# EAGLE design final version (EAGLE 8.7.0)
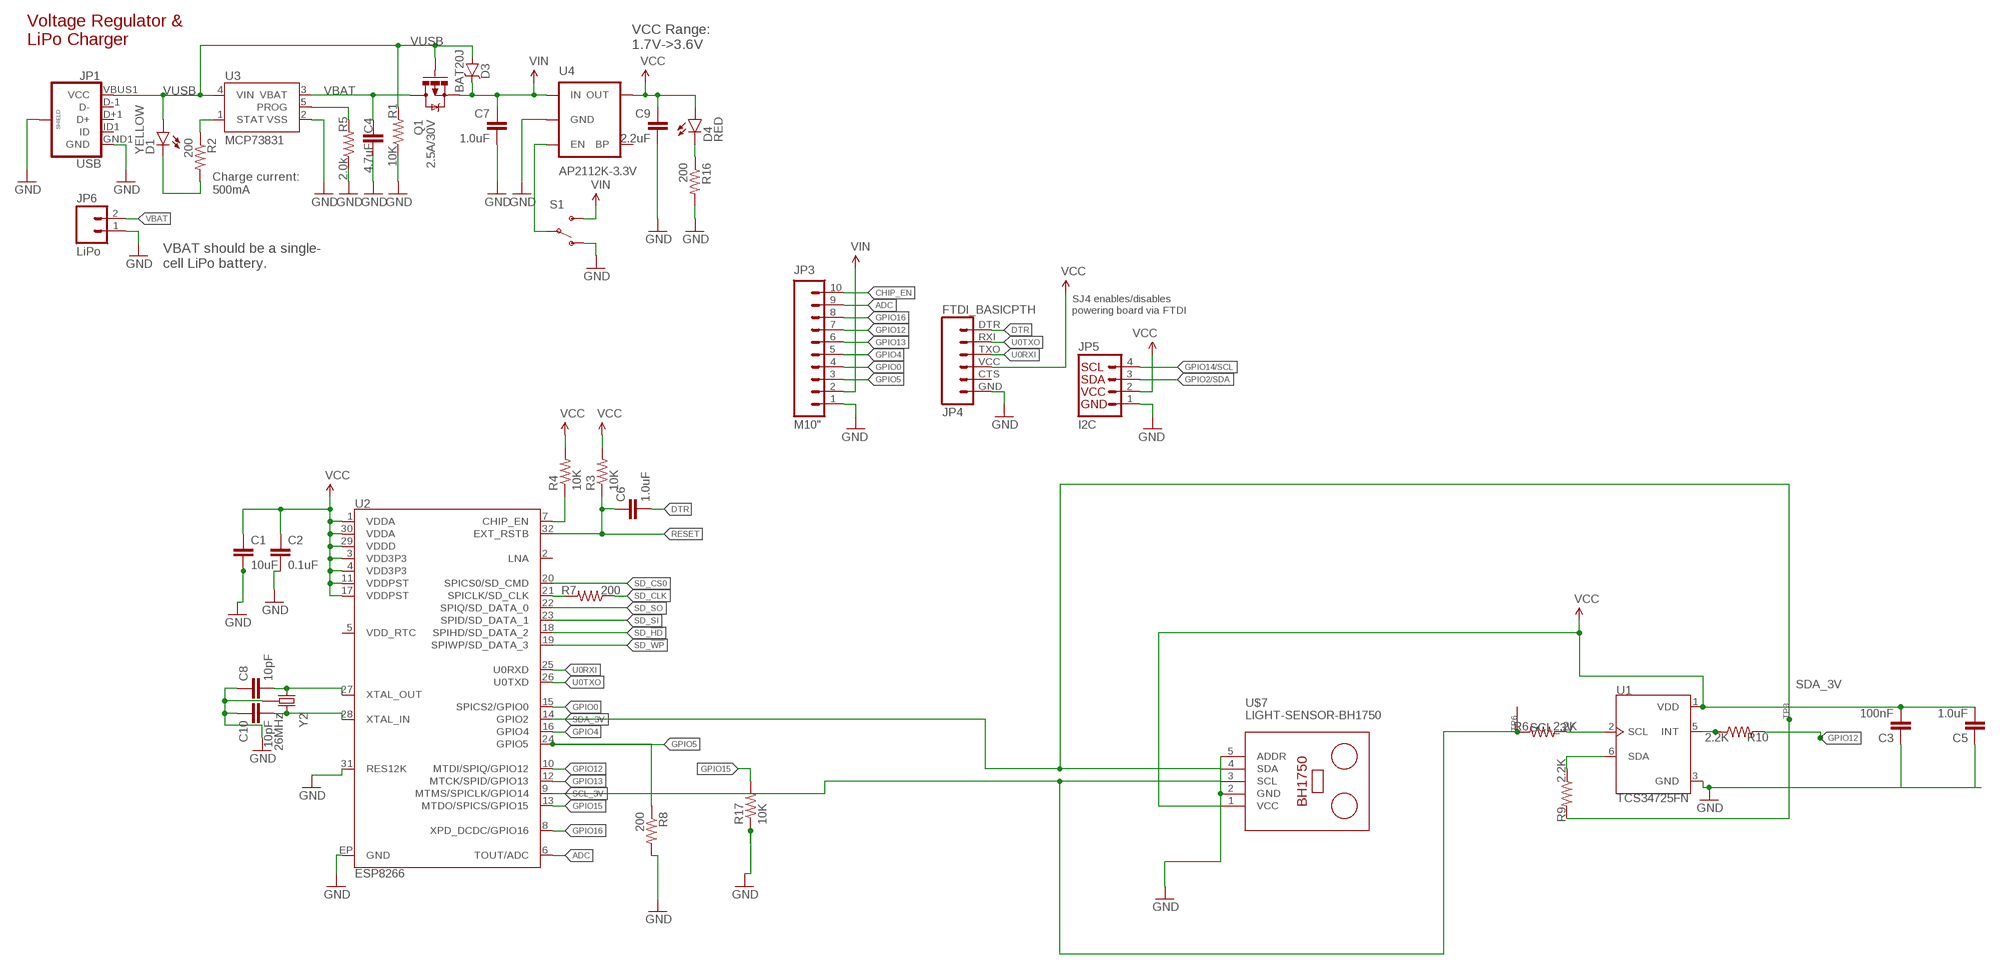
[diagram p0: schematic, sheet 1]

## Parts
C1  10uF  10UF-6.3V-20%(0603)  [0603-CAP]
C2  0.1uF  0.1UF-25V(+80/-20%)(0603)  [0603-CAP]
C3  100nF  1.0UF-16V-10%(0603)  [0603-CAP]
C4  4.7uF  4.7UF-6.3V-10%(0603)0603  [0603-CAP]
C5  1.0uF  1.0UF-16V-10%(0603)  [0603-CAP]
C6  1.0uF  1.0UF-16V-10%(0603)  [0603-CAP]
C7  1.0uF  1.0UF-25V-+80/-20(0805)  [0805]
C8  10pF  10PF-50V-5%(0603)  [0603-CAP]
C9  2.2uF  2.2UF-10V-20%(0603)  [0603-CAP]
C10  10pF  10PF-50V-5%(0603)  [0603-CAP]
D1  YELLOW  LED-YELLOW0603  [LED-0603]
D3  BAT20J  DIODE-SCHOTTKY-BAT20J  [SOD-323]
D4  RED  LED-RED0603  [LED-0603]
JP1  USB  USB_MICROB_PLUGCONN-11752  [USB-B-MICRO-SMD_V03]
JP3  M10"  [1X10]
JP4  FTDI_BASICPTH  [FTDI_BASIC]
JP5  I2C  I2C_STANDARD  [1X04]
JP6  LiPo  M02JST-PTH-2  [JST-2-PTH]
Q1  2.5A/30V  MOSFET-PCHANNELDMG2307L  [SOT23-3]
R1  10K  10KOHM1/10W1%(0603)0603  [0603-RES]
R2  200  200OHM1/10W1%(0603)  [0603-RES]
R3  10K  10KOHM1/10W1%(0603)0603  [0603-RES]
R4  10K  10KOHM1/10W1%(0603)0603  [0603-RES]
R5  2.0k  2.0KOHM1/10W5%(0603)  [0603-RES]
R6  2.2K  200OHM1/10W1%(0603)  [0603-RES]
R7  200  200OHM1/10W1%(0603)  [0603-RES]
R8  200  200OHM1/10W1%(0603)  [0603-RES]
R9  2.2K  200OHM1/10W1%(0603)  [0603-RES]
R10  2.2K  200OHM1/10W1%(0603)  [0603-RES]
R16  200  200OHM1/10W1%(0603)  [0603-RES]
R17  10K  10KOHM1/10W1%(0603)0603  [0603-RES]
S1  SWITCH-SPDT-SMD-A  [SWITCH-SPST-SMD-A]
TP3  SEWTAP0.5IN  [SEWINGTAP_0.5]
TP6  SEWTAP0.5IN  [SEWINGTAP_0.5]
U1  TCS34725FN  [SON65P200X240X70-6N]
U2  ESP8266  [QFN32]
U3  MCP73831  [SOT23-5]
U4  AP2112K-3.3V  V_REG_LDOSMD  [SOT23-5]
U$7  LIGHT-SENSOR-BH1750  [LIGHT-SENSOR-BH1750]
Y2  26MHz  CRYSTAL-GROUNDED3.2X2.5  [CRYSTAL-SMD-3.2X2.5]

## Nets
ADC: JP3.9 U2.6(TOUT/ADC)
CHIP_EN: JP3.10 R4.1 U2.7(CHIP_EN)
DTR: C6.2 JP4.DTR
GND: C1.2 C2.2 C3.1 C4.2 C5.1 C7.2 C8.1 C9.2 C10.1 JP1.GND1(GND) JP1.SHIELD1(SHIELD) JP1.SHIELD2(SHIELD) JP1.SHIELD3(SHIELD) JP3.1 JP4.GND JP5.1 JP6.1 R1.1 R5.1 R8.2 R16.2 R17.1 S1.1(O) U1.3(GND) U2.31(RES12K) U2.EP(GND) U3.2(VSS) U4.2(GND) U$7.2(GND) U$7.5(ADDR) Y2.2(GND) Y2.4(GND)
GPIO0: JP3.4 U2.15(SPICS2/GPIO0)
GPIO2/SDA: JP5.3
GPIO4: JP3.5 U2.16(GPIO4)
GPIO5: JP3.3 R8.1 U2.24(GPIO5)
GPIO12: JP3.7 U2.10(MTDI/SPIQ/GPIO12)
GPIO13: JP3.6 U2.12(MTCK/SPID/GPIO13)
GPIO14/SCL: JP5.4
GPIO15: R17.2 U2.13(MTDO/SPICS/GPIO15)
GPIO16: JP3.8 U2.8(XPD_DCDC/GPIO16)
N$1: R10.1 U1.5(INT)
N$2: R9.1 U1.6(SDA)
N$3: R6.1 U1.2(SCL)
N$4: C10.2 U2.28(XTAL_IN) Y2.3
N$5: D4.C R16.1
N$6: C8.2 U2.27(XTAL_OUT) Y2.1
N$7: R10.2
N$8: S1.2(P) U4.3(EN)
N$9: R7.2 U2.21(SPICLK/SD_CLK)
N$14: R5.2 U3.5(PROG)
N$17: D1.C R2.2
N$18: R2.1 U3.1(STAT)
RESET: C6.1 R3.1 U2.32(EXT_RSTB)
SCL_3V: R6.2 TP6.TAP(SEW) U2.9(MTMS/SPICLK/GPIO14) U$7.3(SCL)
SD_!HD!: U2.18(SPIHD/SD_DATA_2)
SD_!WP!: U2.19(SPIWP/SD_DATA_3)
SD_CLK: R7.1
SD_CS0: U2.20(SPICS0/SD_CMD)
SD_SI: U2.23(SPID/SD_DATA_1)
SD_SO: U2.22(SPIQ/SD_DATA_0)
SDA_3V: R9.2 TP3.TAP(SEW) U2.14(GPIO2) U$7.4(SDA)
U0RXI: JP4.TXO U2.25(U0RXD)
U0TXO: JP4.RXI U2.26(U0TXD)
VBAT: C4.1 JP6.2 Q1.3(D) U3.3(VBAT)
VCC: C1.1 C2.1 C3.2 C5.2 C9.1 D4.A JP4.VCC JP5.2 R3.2 R4.2 U1.1(VDD) U2.1(VDDA) U2.3(VDD3P3) U2.4(VDD3P3) U2.11(VDDPST) U2.17(VDDPST) U2.29(VDDD) U2.30(VDDA) U4.5(OUT) U$7.1(VCC)
VIN: C7.1 D3.C JP3.2 Q1.2(S) S1.3(S) U4.1(IN)
VUSB: D1.A D3.A JP1.VBUS1(VCC) Q1.1(G) R1.2 U3.4(VIN)
Unconnected: JP1.D+1(D+) JP1.D-1(D-) JP1.ID1(ID) JP4.CTS U2.2(LNA) U2.5(VDD_RTC) U4.4(BP)

## Notes on the sheet
- Voltage Regulator &
  LiPo Charger
- VCC Range:
  1.7V->3.6V
- Charge current:
  500mA
- VBAT should be a single-
  cell LiPo battery.
- SJ4 enables/disables
  powering board via FTDI

## Library data of the parts
C1 = SparkFun-Capacitors:10UF-6.3V-20%(0603): CAP-11015; PROD_ID: CAP-11015
C2 = SparkFun-Capacitors:0.1UF-25V(+80/-20%)(0603): CAP-00810 Ceramic Standard decoupling cap; PROD_ID: CAP-00810
C3 = SparkFun-Capacitors:1.0UF-16V-10%(0603): CAP-00868; PROD_ID: CAP-00868; VALUE: 1.0uF
C4 = SparkFun-Capacitors:4.7UF-6.3V-10%(0603): CAP-08280; PROD_ID: CAP-08280
C5 C6 = SparkFun-Capacitors:1.0UF-16V-10%(0603): CAP-00868; PROD_ID: CAP-00868
C7 = SparkFun-Capacitors:1.0UF-25V-+80/-20(0805): CAP-11625; PROD_ID: CAP-11625
C8 C10 = SparkFun-Capacitors:10PF-50V-5%(0603): CAP-11812; PROD_ID: CAP-11812
C9 = SparkFun-Capacitors:2.2UF-10V-20%(0603): CAP-07888; PROD_ID: CAP-07888
D1 = SparkFun-LED:LED-YELLOW: Yellow SMD LEDs LilyPad 1206- DIO-09909 0603- DIO-09003; PROD_ID: DIO-09003
D3 = SparkFun-DiscreteSemi:DIODE-SCHOTTKY: Schottky diodes in SFE's production catalog BAT20J 1A 23V 0.62Vf RB751 120mA 40V 0.37Vf PMEG4005EJ 0.5A 40V 0.42Vf MBRA140 1A 40V 0.5Vf B340A 3A 40V SMA; PROD_ID: DIO-11623
D4 = SparkFun-LED:LED-RED: Assorted Red LEDs LilyPad 1206- DIO-09912 1206- DIO-00809 0603- DIO-00819; PROD_ID: DIO-00819
JP1 = SparkFun-Connectors:USB_MICROB_PLUG: USB Micro-B connectors Some male, some female. Watch your step!; PROD_ID: CONN-11752
JP3 = SparkFun-Connectors:M10: Header 10 Standard 10-pin 0.1" header. Use with straight break away headers (SKU : PRT-00116), right angle break away headers (PRT-00553), swiss pins (PRT-00743), machine pins (PRT-00117), and female headers (PRT-00115).
JP4 = SparkFun-Connectors:FTDI_BASIC: FTDI Basic header with labels
JP5 = SparkFun-Connectors:I2C_STANDARD: SparkFun has standardized on a pinout for all I2C based sensor breakouts. This pinout allows I2C boards to be plugged directly into the headers on Arduino Uno compatible boards, and to be daisy chained easily.
JP6 = SparkFun-Connectors:M02: Standard 2-pin 0.1" header. Use with - straight break away headers ( PRT-00116) - right angle break away headers (PRT-00553) - swiss pins (PRT-00743) - machine pins (PRT-00117) - female headers (PRT-00115) Molex polarized connector foot print use with: PRT-08233 with associated crimp pins and housings. 2.54_SCREWTERM for use with PRT-10571. 3.5mm Screw Terminal footprints for PRT-08084 5mm Screw Terminal footprints for use with PRT-08432; SKU: PRT-09914
Q1 = SparkFun-DiscreteSemi:MOSFET-PCHANNEL: Generic PMOSFET IRLML2244 - TRANS-11153 (SOT-23 -20V -4.3A) (1.Gate 2.Source 3.Drain) FQP27P06 - COM-10349 <http://www.sparkfun.com/products/10349> (TO-220 -60V -27A) (1.Gate 2.Source 3.Drain); PROD_ID: TRANS-11308
R1 R3 R4 R17 = SparkFun-Resistors:10KOHM1/10W1%(0603): RES-00824; PROD_ID: RES-00824
R2 R7 R8 R16 = SparkFun-Resistors:200OHM1/10W1%(0603): RES-08220; PROD_ID: RES-08220
R5 = SparkFun-Resistors:2.0KOHM1/10W5%(0603): RES-08296; PROD_ID: RES-08296
R6 R9 R10 = SparkFun-Resistors:200OHM1/10W1%(0603): RES-08220; PROD_ID: RES-08220; VALUE: 200
S1 = SparkFun-Electromechanical:SWITCH-SPDT: SPDT Switch Simple slide switch, Spark Fun Electronics SKU : COM-00102 DPDT SMT slide switch, AYZ0202, SWCH-08179; PROD_ID: SWCH-10651
TP3 TP6 = adafruit:SEWTAP
U1 = TCS34725FN:TCS34725FN: Color Light To Digital with IR Filter; DESCRIPTION: Color Light To Digital with IR Filter; DIGI-KEY_PART_NUMBER: TCS34725FNCT-ND; DIGI-KEY_PURCHASE_URL: https://www.digikey.com/product-detail/en/ams/TCS34725FN/TCS34725FNCT-ND/3737688?utm_source=snapeda&utm_medium=aggregator&utm_campaign=symbol; MF: ams; MP: TCS34725FN; PACKAGE: SMD-6 ams
U2 = SparkFun-RF:ESP8266: Espressif ESP8266 WiFi Smart Connectivity Platform.; PROD_ID: IC-12452
U3 = SparkFun-PowerIC:MCP73831: Miniature single cell, fully integrated Li-Ion, Li-polymer charge management controller http://ww1.microchip.com/downloads/en/DeviceDoc/21984a.pdf IC-09995; PROD_ID: IC-09995
U4 = SparkFun-PowerIC:V_REG_LDO: Voltage Regulator LDO Standard 150mA LDO voltage regulator in SOT-23 layout. Micrel part MIC5205. BP (by-pass) pin is used to lower output noise with 470pF cap.; PROD_ID: VREG-12457
U$7 = diy-modules:LIGHT-SENSOR-BH1750: Digital Light Sensor based on BH1750 BH1750 datasheet is available here: http://www.mouser.com/ds/2/348/bh1750fvi-e-186247.pdf Arduino Library for BH1750 is available here: https://github.com/claws/BH1750 Video Tutorial is available here: https://www.youtube.com/watch?v=UsLcHSbxf_8 Click here to find device on ebay.com <http://www.ebay.com/sch/bh1750fvi+module> Note: There are many variants. Search for the proper version.
Y2 = things:CRYSTAL-GROUNDED; PROD_ID: XTAL-12454

## Board
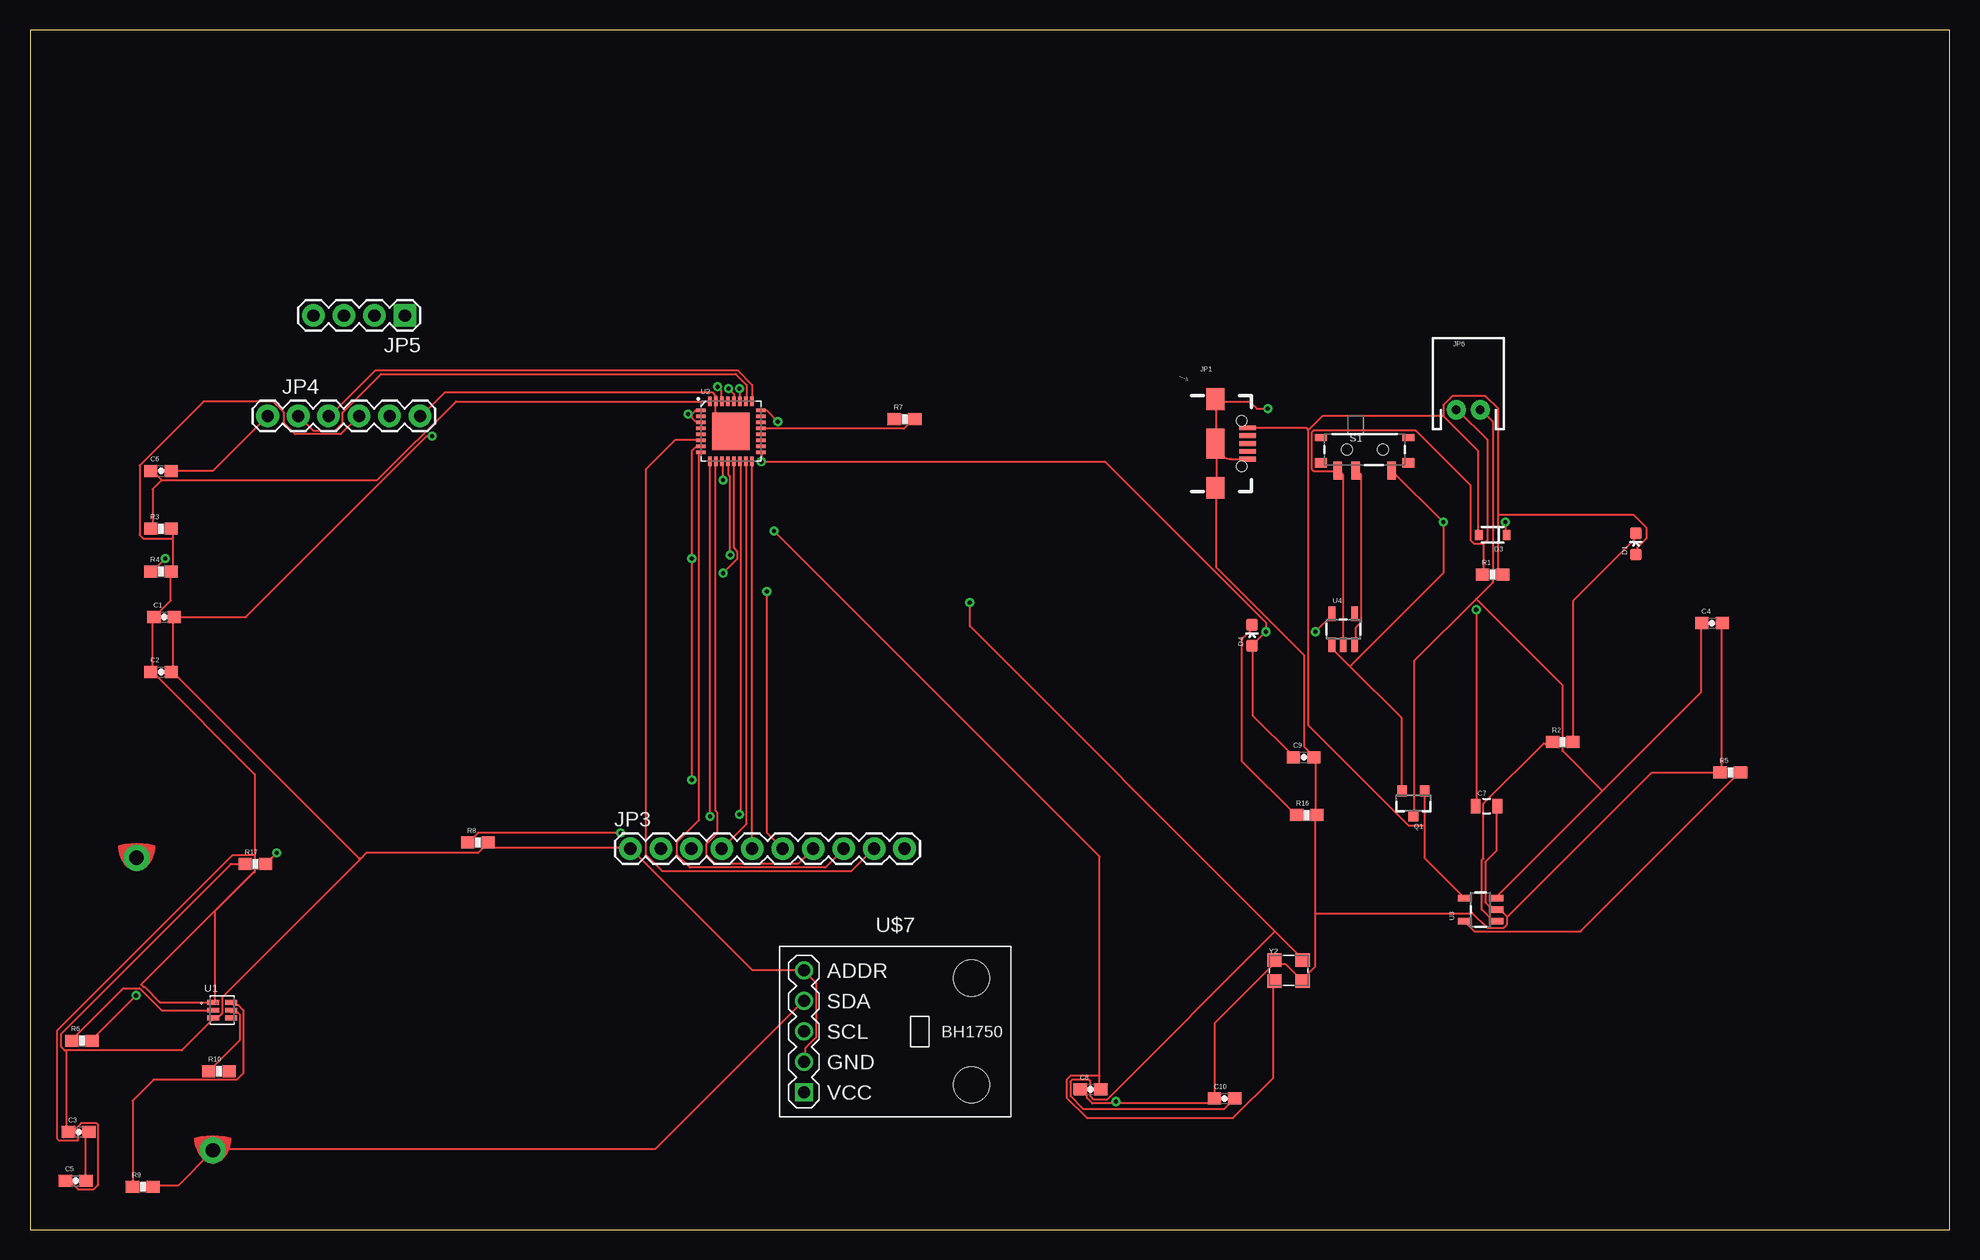
[diagram p1: board, top side]
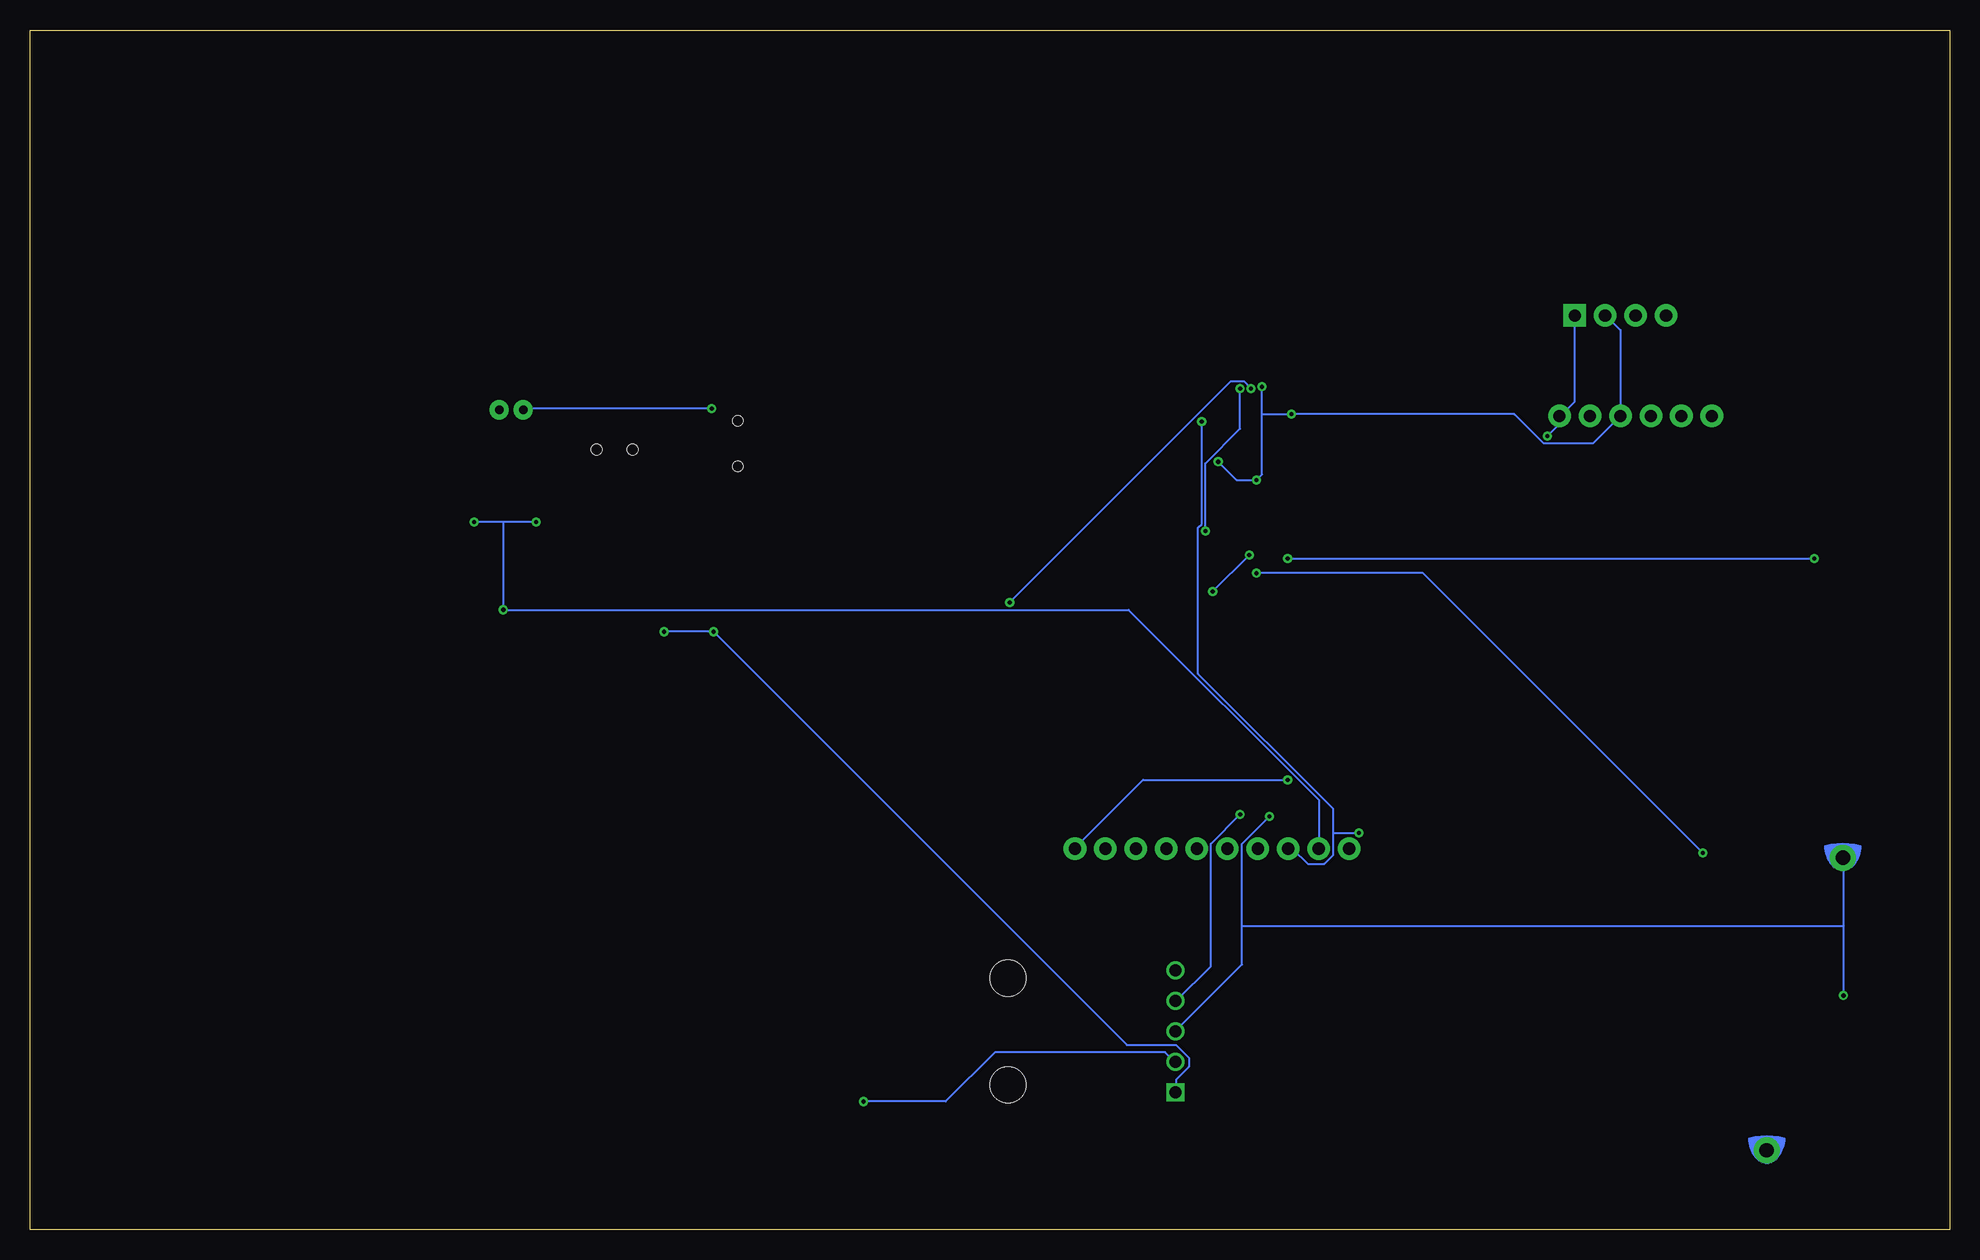
[diagram p2: board, bottom side, seen from below]

Size 160 x 100 mm. Coordinates in mm from the lower left corner, seen from the top.
Outline: 0,0 160,0 160,100 0,100 0,0
Copper layers (1*16): Top 0.035mm / dielectric 1.5mm / Bottom 0.035mm
Design rules "default": minimum track width 6mil, minimum drill 0.35mm, track to track 6mil, track to pad 6mil, pad to pad 6mil, via to via 6mil, smd to smd 6mil, copper to edge 40mil, drill to drill 6mil, minimum pad ring 10mil, minimum via ring 8mil, stop-mask expansion 4mil, vias tented up to drill 0mil, thermal gap 10mil

### Footprints (pad centres in the part's own frame; a part is rotated, then mirrored left to right if it is on the bottom)
0603-CAP = smd 1.1 x 1: 1 -0.85,0; 2 0.85,0
0805 = smd 0.8 x 1.2: 1 -0.9,0; 2 0.9,0
LED-0603 = smd 1 x 1: A 0,-0.877; C 0,0.877
SOD-323 = smd 0.63 x 0.83: A 1.15,0; C -1.15,0
USB-B-MICRO-SMD_V03 = smd 1.4 x 0.4: D+1 2.7,0; D-1 2.7,0.65; GND1 2.7,-1.3; ID1 2.7,-0.65; VBUS1 2.7,1.3 | smd 1.5 x 1.8: SHIELD1 0,3.7; SHIELD2 0,-3.7 | smd 1.5 x 2.5: SHIELD3 0,0 | hole 0.85: 2.2,1.9; 2.2,-1.9
1X10 = drill 1.016 pad 1.88: 1 0,0; 2 2.54,0; 3 5.08,0; 4 7.62,0; 5 10.16,0; 6 12.7,0; 7 15.24,0; 8 17.78,0; 9 20.32,0; 10 22.86,0
FTDI_BASIC = drill 1.016 pad 1.88: CTS 10.16,0; DTR 0,0; GND 12.7,0; RXI 2.54,0; TXO 5.08,0; VCC 7.62,0
1X04 = drill 1.016 pad 1.88 square: 1 0,0 | drill 1.016 pad 1.88: 2 2.54,0; 3 5.08,0; 4 7.62,0
JST-2-PTH = drill 0.7 pad 1.6: 1 -1,0; 2 1,0
SOT23-3 = smd 0.8 x 0.9: 1 -0.95,-1; 2 0.95,-1; 3 0,1.1
0603-RES = smd 1.1 x 1: 1 -0.85,0; 2 0.85,0
SWITCH-SPST-SMD-A = smd 0.7 x 1.5: 1 -2.25,-1.75; 2 -0.75,-1.75; 3 2.25,-1.75 | smd 1 x 0.6: GND1 -3.65,1; GND3 3.65,1 | smd 1 x 0.8: GND2 -3.65,-1.1; GND4 3.65,-1.1 | hole 0.9: -1.5,0; 1.5,0
SEWINGTAP_0.5 = drill 1.2 pad 2.184: TAP 0,0
SON65P200X240X70-6N = smd 1 x 0.4: 1 -0.75,0.65; 2 -0.75,0; 3 -0.75,-0.65; 4 0.75,-0.65; 5 0.75,0; 6 0.75,0.65
QFN32 = smd 0.8 x 0.285: 1 -2.5,1.75; 2 -2.5,1.25; 3 -2.5,0.75; 4 -2.5,0.25; 5 -2.5,-0.25; 6 -2.5,-0.75; 7 -2.5,-1.25; 8 -2.5,-1.75; 17 2.5,-1.75; 18 2.5,-1.25; 19 2.5,-0.75; 20 2.5,-0.25; 21 2.5,0.25; 22 2.5,0.75; 23 2.5,1.25; 24 2.5,1.75 | smd 0.285 x 0.8: 9 -1.75,-2.5; 10 -1.25,-2.5; 11 -0.75,-2.5; 12 -0.25,-2.5; 13 0.25,-2.5; 14 0.75,-2.5; 15 1.25,-2.5; 16 1.75,-2.5; 25 1.75,2.5; 26 1.25,2.5; 27 0.75,2.5; 28 0.25,2.5; 29 -0.25,2.5; 30 -0.75,2.5; 31 -1.25,2.5; 32 -1.75,2.5 | smd 3.15 x 3.15: EP 0,0
SOT23-5 = smd 0.55 x 1.2: 1 -0.95,-1.3; 2 0,-1.3; 3 0.95,-1.3; 4 0.95,1.3; 5 -0.95,1.3
LIGHT-SENSOR-BH1750 = drill 1 square: 1 -7.62,-5.08 | drill 1: 2 -7.62,-2.54; 3 -7.62,0; 4 -7.62,2.54; 5 -7.62,5.08 | hole 3: 6.35,4.445; 6.35,-4.445
CRYSTAL-SMD-3.2X2.5 = smd 1.2 x 1.1: 1 -1.175,-0.875; 2 1.175,-0.875; 3 1.175,0.875; 4 -1.175,0.875

### Placement (x,y rotation side)
C1  11.18,51.05 0 top
C2  10.92,46.48 0 top
C3  4.06,8.13 0 top
C4  140.21,50.55 0 top
C5  3.81,4.06 0 top
C6  10.92,63.25 0 top
C7  121.41,35.31 0 top
C8  88.39,11.68 0 top
C9  106.17,39.37 0 top
C10  99.57,10.92 0 top
D1  133.86,57.15 0 top
D3  121.92,57.91 180 top
D4  101.85,49.53 0 top
JP1  98.81,65.53 0 top
JP3  50.04,31.75 0 top
JP4  19.81,67.82 0 top
JP5  31.24,76.2 180 top
JP6  119.89,68.33 0 top
Q1  115.32,35.56 180 top
R1  121.92,54.61 0 top
R2  127.76,40.64 0 top
R3  10.92,58.42 0 top
R4  10.92,54.86 0 top
R5  141.73,38.1 0 top
R6  4.32,15.75 0 top
R7  72.9,67.56 0 top
R8  37.34,32.26 0 top
R9  9.4,3.56 0 top
R10  15.75,13.21 0 top
R16  106.43,34.54 0 top
R17  18.8,30.48 0 top
S1  111.25,65.02 0 top
TP3  15.24,6.6 0 top
TP6  8.89,30.99 0 top
U1  16,18.29 0 top
U2  58.42,66.55 0 top
U3  120.9,26.67 90 top
U4  109.47,50.04 0 top
U$7  72.14,16.51 0 top
Y2  104.9,21.59 0 top

### Tracks (layer width: path | path; a pad name or v marks a point on that pad's centre or on a via)
ADC
  Top 0.152: U2.6 55.78,65.84 53.8,65.84 51.36,63.4 51.36,31.24 52.73,29.87 68.43,29.87 70.26,31.7 JP3.9
CHIP_EN  (via drill 0.35)
  Top 0.152: v55.17,37.49 v55.17,55.93 55.17,64.92 55.47,65.23 55.78,65.23 U2.7 | v11.28,55.93 10.21,54.86 R4.1
  Bottom 0.152: v55.17,37.49 67.21,37.49 72.85,31.85 JP3.10 | v55.17,55.93 v11.28,55.93
DTR
  Top 0.152: C6.2 15.24,63.25 JP4.DTR
GND  (via drill 0.35)
  Top 0.152: U4.2 109.42,48.77 109.42,62.94 109.12,63.25 S1.1 108.97,63.25 106.98,63.25 106.83,63.4 106.83,66.45 106.98,66.6 115.52,66.6 120.09,62.03 120.09,57.45 120.4,57.15 121.16,57.15 | 121.16,57.15 121.16,54.71 R1.1 | 121.16,57.15 121.46,57.45 121.46,65.84 119.02,68.28 JP6.1 | C4.2 140.97,50.44 140.97,38.1 R5.1 135.18,38.1 123.14,26.06 | 98.91,65.53 98.91,61.87 JP1.SHIELD2 98.91,61.72 98.91,55.17 106.22,47.85 106.22,40.23 106.98,39.47 C9.2 107.14,39.32 107.14,34.59 R16.2 107.14,34.44 107.14,26.36 | 98.91,65.53 98.91,69.04 | 98.91,69.04 98.91,69.19 JP1.SHIELD1 98.91,69.04 | 98.91,65.53 JP1.SHIELD3 arc90 100.11,64.23 JP1.GND1 | C7.2 122.22,35.2 122.22,31.55 121.31,30.63 121.31,27.28 121.61,26.98 121.77,26.98 122.07,26.67 U3.2 122.53,26.67 123.14,26.06 | 90.53,10.52 98.3,10.52 98.6,10.82 C10.1 98.75,10.97 98.75,17.22 103.63,22.1 | 90.53,10.52 88.54,10.52 88.09,10.97 88.09,11.12 87.63,11.58 C8.1 | 103.63,22.1 Y2.4 | 107.14,26.36 107.14,21.95 106.22,21.03 Y2.2 104.69,22.1 103.63,22.1 | 123.14,26.06 123.14,25.45 122.83,25.15 121.46,25.15 120.24,26.36 107.14,26.36 | v103.17,68.43 102.26,68.43 101.65,69.04 98.91,69.04 | U2.EP 57.15,67.82 57.15,69.04 U2.31 57.15,69.19 57.15,69.49 56.84,69.8 34.59,69.8 32.61,67.82 JP4.GND | U$7.2 64.62,14.02 64.62,15.09 65.53,16 65.53,20.57 U$7.5 64.47,21.64 60.2,21.64 50.14,31.7 JP3.1 49.99,31.85 38.56,31.85 38.25,32.16 R8.2 38.1,32.16 37.34,31.39 28.04,31.39 27.58,30.94 | 11.89,46.48 11.89,51.05 C1.2 17.98,51.05 33.07,66.14 v33.53,66.14 | 27.58,30.94 16,19.36 16,17.98 15.7,17.68 15.39,17.68 U1.3 15.24,17.53 12.65,14.94 3.05,14.94
  Top 0.152: R17.1 16.76,30.48 2.59,16.31 2.59,15.24 2.9,14.94 3.05,14.94 | 11.89,46.48 27.43,30.94 27.58,30.94 | 11.89,46.48 C2.2 | v90.53,10.67 90.53,10.52 | 3.05,14.94 3.05,8.29 arc90 C3.1 2.96,7.87 3.29,7.87 4.27,8.86 5.56,8.86 5.69,8.72 5.69,3.72 5.3,3.33 4.01,3.33 3.29,4.06 C5.1
  Bottom 0.152: v103.17,68.43 118.87,68.43 JP6.1 | JP5.1 31.24,69.04 32.46,67.82 JP4.GND 32.61,67.82 32.61,67.06 v33.53,66.14 | v90.53,10.67 83.67,10.67 79.55,14.78 65.38,14.78 64.62,14.02 U$7.2
GPIO0
  Top 0.152: JP3.4 59.74,33.83 59.74,64.01 U2.15
GPIO4
  Top 0.152: JP3.5 60.2,64.01 U2.16
GPIO5  (via drill 0.35)
  Top 0.152: v62.33,67.36 61.42,68.28 60.96,68.28 U2.24 | v49.23,33.07 37.34,33.07 36.58,32.31 R8.1
  Bottom 0.152: v62.33,67.36 62.33,58.83 62.64,58.52 62.64,46.33 51.36,35.05 51.36,33.07 | 51.36,33.07 51.36,31.24 52.12,30.48 53.49,30.48 54.71,31.7 JP3.3 | 51.36,33.07 v49.23,33.07
  Bottom 0.813: 55.17,31.85 JP3.3
GPIO12
  Top 0.152: JP3.7 64.01,30.48 57.15,30.48 56.39,31.24 56.39,32.16 57.3,33.07 57.3,34.75 57.15,34.9 57.15,64.01 U2.10
GPIO13  (via drill 0.35)
  Top 0.152: v58.37,56.24 58.37,62.79 58.22,62.94 58.22,64.01 U2.12 | v61.42,53.19 61.42,33.07 JP3.6
  Bottom 0.152: v61.42,53.19 v58.37,56.24
GPIO15  (via drill 0.35)
  Top 0.152: v57.76,54.71 58.98,55.93 58.98,56.54 58.67,56.84 58.67,64.01 U2.13 | v20.57,31.39 R17.2
  Bottom 0.152: v57.76,54.71 43.89,54.71 v20.57,31.39
GPIO16
  Top 0.152: U2.8 55.78,64.77 55.78,34.14 53.95,32.31 53.95,31.24 55.02,30.18 66.29,30.18 67.82,31.7 JP3.8
N$1
  Top 0.152: 16.75,18.07 U1.5 16.97,18.07 17.35,18.07 17.48,17.93 17.48,15.79 R10.1
N$2
  Top 0.152: R9.1 8.55,10.73 10.29,12.48 17.24,12.48 17.79,13.02 17.79,18.28 17.35,18.72 16.97,18.72 U1.6
N$3
  Top 0.152: U1.2 10.97,18.29 9.14,20.12 7.77,20.12 3.5,15.85 R6.1
N$4  (via drill 0.35)
  Top 0.152: v58.22,70.1 58.67,69.65 58.67,69.19 U2.28 | v78.33,52.27 78.33,50.29 103.78,24.84 | 103.78,24.84 106.07,22.55 Y2.3 | 103.78,24.84 89.76,10.82 88.7,10.82 88.39,11.12 88.39,12.34 88.24,12.5 86.87,12.5 86.72,12.34 86.72,11.12 87.78,10.06 99.52,10.06 99.55,10.06 C10.2
  Top 0.813: 100.28,10.82 C10.2
  Bottom 0.152: v58.22,70.1 58.83,70.71 59.89,70.71 v78.33,52.27
N$5
  Top 0.152: D4.C 101.8,50.29 101.8,49.99 101.04,49.23 101.04,39.01 105.46,34.59 R16.1
N$6  (via drill 0.35)
  Top 0.152: v59.13,70.1 59.13,69.19 U2.27 | v62.03,58.22 89.15,31.09 89.15,12.8 | 89.15,12.8 89.15,11.73 C8.2 | 89.15,12.8 86.72,12.8 86.41,12.5 86.41,10.97 88.09,9.3 100.28,9.3 103.63,12.65 103.63,20.57 Y2.1
  Bottom 0.152: v59.13,70.1 59.13,66.75 62.03,63.86 v62.03,58.22
N$8
  Top 0.152: U4.3 110.49,48.77 110.49,50.14 110.95,50.6 110.95,62.94 110.64,63.25 S1.2
N$9
  Top 0.152: U2.21 60.96,66.75 72.85,66.75 73.61,67.51 R7.2
N$14
  Top 0.152: R5.2 142.49,38.1 129.24,24.84 120.4,24.84 119.63,25.6 U3.5
N$17
  Top 0.152: D1.C 133.81,57.91 133.81,57.61 128.63,52.43 128.63,40.69 R2.2
N$18
  Top 0.152: R2.1 126.8,40.54 126.19,40.54 121.16,35.51 121.16,30.94 121.01,30.79 121.01,26.67 122.07,25.6 U3.1
RESET
  Top 0.152: 10.97,62.48 28.96,62.48 35.51,69.04 56.54,69.04 U2.32 | 10.97,62.48 10.21,63.25 C6.1 | 10.97,62.48 10.21,61.72 10.21,58.52 R3.1
SCL_3V  (via drill 0.35)
  Top 0.152: v8.84,19.51 5.18,15.85 R6.2 | v56.69,34.44 56.69,64.01 U2.9
  Bottom 0.152: 8.84,25.3 8.84,30.94 TP6.TAP | 8.84,25.3 v8.84,19.51 | v56.69,34.44 58.98,32.16 58.98,25.3 | 58.98,25.3 58.98,22.1 64.47,16.61 U$7.3 | 58.98,25.3 8.84,25.3
SDA_3V  (via drill 0.35)
  Top 0.152: R9.2 10.36,3.66 12.34,3.66 15.24,6.55 TP3.TAP 15.24,6.71 52.12,6.71 64.47,19.05 U$7.4 | v59.13,34.59 59.28,34.75 59.28,64.01 U2.14
  Bottom 0.152: v59.13,34.59 61.57,32.16 61.57,21.95 64.47,19.05 U$7.4
U0RXI
  Top 0.152: U2.25 60.2,69.19 60.2,70.41 58.98,71.63 28.8,71.63 24.99,67.82 JP4.TXO
U0TXO
  Top 0.152: U2.26 59.74,69.19 59.74,70.41 58.83,71.32 29.26,71.32 26.06,68.12 26.06,67.21 25.45,66.6 23.62,66.6 22.4,67.82 JP4.RXI
VBAT
  Top 0.152: 131.06,36.58 122.22,27.74 U3.3 | 131.06,36.58 139.29,44.81 139.29,50.44 C4.1 | 120.55,52.58 121.92,53.95 121.92,67.36 121.01,68.28 JP6.2 | 120.55,52.58 115.37,47.4 115.37,34.59 Q1.3 | 131.06,36.58 127.71,39.93 127.71,45.41 120.55,52.58
VCC  (via drill 0.35)
  Top 0.152: C9.1 105.31,39.47 101.96,42.82 101.96,48.62 D4.A 101.96,48.77 v103.02,49.84 103.02,50.6 89.61,64.01 v60.96,64.01 60.96,64.77 U2.17 | v107.14,49.84 108.51,51.21 U4.5 | 11.89,57.61 11.89,58.37 R3.2 | 11.89,57.61 11.89,54.86 R4.2 11.73,54.86 11.73,52.43 10.36,51.05 C1.1 10.21,51.05 10.21,46.48 | 10.21,46.48 18.75,37.95 18.75,29.87 15.39,26.52 15.39,19.05 U1.1 10.82,18.94 9.55,20.22 9.48,20.22 9.27,20.42 18.6,29.75 18.73,29.75 18.73,31.21 16.88,31.21 2.29,16.61 2.29,7.55 2.44,7.4 3.99,7.4 3.99,8.13 C3.2 4.66,7.87 C5.2 | 10.21,46.48 C2.1 | U2.4 55.93,66.9 55.93,67.21 U2.3 55.78,67.36 55.47,67.36 55.17,67.67 55.17,67.97 | 55.17,67.97 55.47,68.28 55.78,68.28 U2.1 | U2.29 58.06,69.04 57.76,69.04 U2.30 57.61,69.19 57.61,69.95 v57.3,70.26 | v57.76,62.48 57.76,64.01 U2.11 | v54.86,67.97 55.17,67.97 | 11.89,57.61 9.45,57.61 9.14,57.91 9.14,63.7 14.48,69.04 20.27,69.04 21.18,68.12 21.18,67.21 22.1,66.29 25.91,66.29 JP4.VCC
  Bottom 0.152: v107.14,49.84 v103.02,49.84 68.58,15.39 64.47,15.39 63.4,14.33 63.4,13.56 64.47,12.5 64.47,11.43 U$7.1 | v60.96,64.01 59.44,62.48 v57.76,62.48 57.3,62.94 57.3,67.97 | 57.3,67.97 v57.3,70.26 | 57.3,67.97 v54.86,67.97 36.27,67.97 33.83,65.53 29.72,65.53 JP4.VCC 27.43,74.98 28.65,76.2 JP5.2
VIN  (via drill 0.35)
  Top 0.152: 110.03,46.94 108.66,48.31 108.66,48.62 U4.1 | 110.03,46.94 114.3,42.67 114.3,36.58 Q1.2 | v122.99,58.98 122.99,57.91 D3.C | S1.3 113.54,63.25 v117.81,58.98 117.81,54.71 110.03,46.94 | v120.55,51.66 120.55,35.36 C7.1
  Bottom 0.152: v117.81,58.98 120.55,58.98 | 120.55,58.98 v122.99,58.98 | 120.55,58.98 v120.55,51.66 68.43,51.66 52.58,35.81 JP3.2
VUSB
  Top 0.152: 116.28,33.68 116.28,30.94 119.48,27.74 U3.4 | 116.28,33.68 116.28,36.42 Q1.1 | 117.81,67.82 120.7,64.92 120.7,57.91 D3.A | 117.81,67.82 117.81,68.73 118.57,69.49 121.31,69.49 122.38,68.43 122.38,59.59 | 122.38,59.59 122.38,55.02 122.68,54.71 R1.2 | 122.38,59.59 133.66,59.59 134.72,58.52 134.72,57.61 133.96,56.84 133.96,56.39 D1.A | 116.28,33.68 114.91,33.68 106.53,42.06 106.53,66.6 | 106.53,66.6 107.75,67.82 117.81,67.82 | 106.53,66.6 arc90 106.29,66.83 JP1.VBUS1